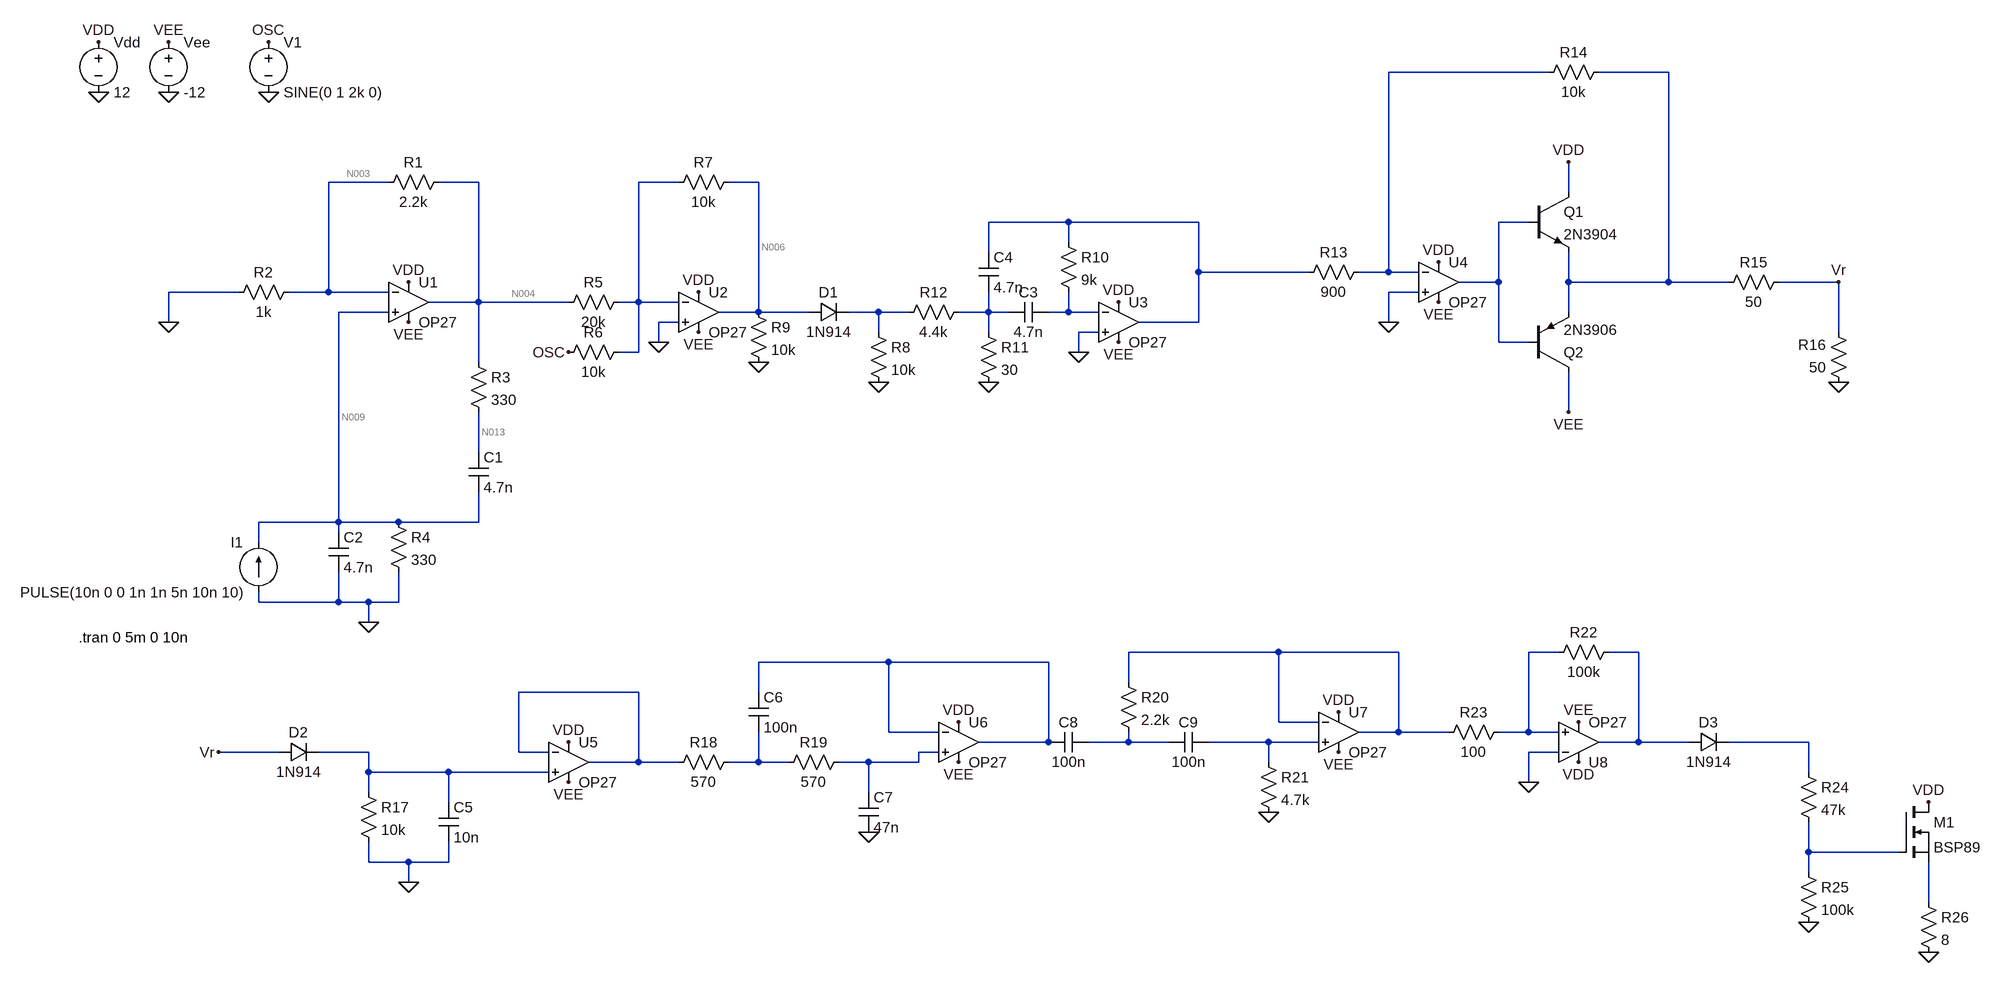
[diagram p0: schematic Project.asc]
Project.asc, the LTspice schematic file:
Version 4
SHEET 1 3028 1572
WIRE 2336 144 2080 144
WIRE 2528 144 2416 144
WIRE 480 320 384 320
WIRE 624 320 560 320
WIRE 944 320 880 320
WIRE 1072 320 1024 320
WIRE 2368 336 2368 288
WIRE 1568 384 1440 384
WIRE 1776 384 1568 384
WIRE 2304 384 2256 384
WIRE 1568 416 1568 384
WIRE 1440 432 1440 384
WIRE 1776 464 1776 384
WIRE 1952 464 1776 464
WIRE 2080 464 2080 144
WIRE 2080 464 2032 464
WIRE 2128 464 2080 464
WIRE 2256 480 2256 384
WIRE 2256 480 2192 480
WIRE 2368 480 2368 432
WIRE 2528 480 2528 144
WIRE 2528 480 2368 480
WIRE 2624 480 2528 480
WIRE 2800 480 2704 480
WIRE 240 496 128 496
WIRE 384 496 384 320
WIRE 384 496 320 496
WIRE 480 496 384 496
WIRE 2128 496 2080 496
WIRE 624 512 624 320
WIRE 624 512 544 512
WIRE 768 512 624 512
WIRE 880 512 880 320
WIRE 880 512 848 512
WIRE 944 512 880 512
WIRE 480 528 400 528
WIRE 1072 528 1072 320
WIRE 1072 528 1008 528
WIRE 1152 528 1072 528
WIRE 1264 528 1216 528
WIRE 1312 528 1264 528
WIRE 1440 528 1440 496
WIRE 1440 528 1392 528
WIRE 1472 528 1440 528
WIRE 1568 528 1568 496
WIRE 1568 528 1536 528
WIRE 1616 528 1568 528
WIRE 2368 528 2368 480
WIRE 128 544 128 496
WIRE 944 544 912 544
WIRE 1776 544 1776 464
WIRE 1776 544 1680 544
WIRE 2080 544 2080 496
WIRE 1264 560 1264 528
WIRE 1440 560 1440 528
WIRE 1616 560 1584 560
WIRE 2800 560 2800 480
WIRE 912 576 912 544
WIRE 2256 576 2256 480
WIRE 2304 576 2256 576
WIRE 880 592 880 512
WIRE 880 592 848 592
WIRE 1584 592 1584 560
WIRE 624 608 624 512
WIRE 2368 688 2368 624
WIRE 624 752 624 688
WIRE 400 864 400 528
WIRE 400 864 272 864
WIRE 496 864 400 864
WIRE 624 864 624 816
WIRE 624 864 496 864
WIRE 400 880 400 864
WIRE 272 896 272 864
WIRE 272 992 272 976
WIRE 400 992 400 944
WIRE 400 992 272 992
WIRE 448 992 400 992
WIRE 496 992 496 944
WIRE 496 992 448 992
WIRE 448 1024 448 992
WIRE 1904 1072 1664 1072
WIRE 2096 1072 1904 1072
WIRE 2352 1072 2304 1072
WIRE 2480 1072 2432 1072
WIRE 1280 1088 1072 1088
WIRE 1536 1088 1280 1088
WIRE 1664 1120 1664 1072
WIRE 880 1136 688 1136
WIRE 1072 1136 1072 1088
WIRE 1904 1184 1904 1072
WIRE 1968 1184 1904 1184
WIRE 1280 1200 1280 1088
WIRE 1360 1200 1280 1200
WIRE 2096 1200 2096 1072
WIRE 2096 1200 2032 1200
WIRE 2176 1200 2096 1200
WIRE 2304 1200 2304 1072
WIRE 2304 1200 2256 1200
WIRE 2352 1200 2304 1200
WIRE 1536 1216 1536 1088
WIRE 1536 1216 1424 1216
WIRE 1664 1216 1664 1200
WIRE 1664 1216 1600 1216
WIRE 1728 1216 1664 1216
WIRE 1888 1216 1792 1216
WIRE 1968 1216 1888 1216
WIRE 2480 1216 2480 1072
WIRE 2480 1216 2416 1216
WIRE 2560 1216 2480 1216
WIRE 2752 1216 2624 1216
WIRE 304 1232 208 1232
WIRE 448 1232 368 1232
WIRE 688 1232 688 1136
WIRE 736 1232 688 1232
WIRE 1360 1232 1328 1232
WIRE 2352 1232 2304 1232
WIRE 880 1248 880 1136
WIRE 880 1248 800 1248
WIRE 944 1248 880 1248
WIRE 1072 1248 1072 1200
WIRE 1072 1248 1024 1248
WIRE 1120 1248 1072 1248
WIRE 1248 1248 1200 1248
WIRE 1328 1248 1328 1232
WIRE 1328 1248 1248 1248
WIRE 1888 1248 1888 1216
WIRE 448 1264 448 1232
WIRE 576 1264 448 1264
WIRE 736 1264 576 1264
WIRE 2752 1264 2752 1216
WIRE 2304 1280 2304 1232
WIRE 448 1296 448 1264
WIRE 1248 1296 1248 1248
WIRE 576 1312 576 1264
WIRE 2752 1392 2752 1344
WIRE 2896 1392 2752 1392
WIRE 448 1408 448 1376
WIRE 512 1408 448 1408
WIRE 576 1408 576 1376
WIRE 576 1408 512 1408
WIRE 2752 1424 2752 1392
WIRE 512 1440 512 1408
WIRE 2944 1472 2944 1408
FLAG 16 176 0
FLAG 128 176 0
FLAG 16 96 VDD
FLAG 128 96 VEE
FLAG 128 544 0
FLAG 512 480 VDD
FLAG 512 544 VEE
FLAG 448 1024 0
FLAG 288 176 0
FLAG 288 96 OSC
FLAG 976 560 VEE
FLAG 976 496 VDD
FLAG 768 592 OSC
FLAG 912 576 0
FLAG 1264 640 0
FLAG 1072 608 0
FLAG 1648 512 VDD
FLAG 1648 576 VEE
FLAG 1440 640 0
FLAG 1584 592 0
FLAG 2368 288 VDD
FLAG 2160 448 VDD
FLAG 2160 512 VEE
FLAG 2080 544 0
FLAG 2368 688 VEE
FLAG 2800 640 0
FLAG 2800 480 Vr
FLAG 768 1216 VDD
FLAG 768 1280 VEE
FLAG 512 1440 0
FLAG 208 1232 Vr
FLAG 1392 1184 VDD
FLAG 1392 1248 VEE
FLAG 1248 1360 0
FLAG 2000 1168 VDD
FLAG 2000 1232 VEE
FLAG 1888 1328 0
FLAG 2384 1184 VEE
FLAG 2384 1248 VDD
FLAG 2304 1280 0
FLAG 2752 1504 0
FLAG 2944 1552 0
FLAG 2944 1312 VDD
SYMBOL voltage 16 80 R0
SYMATTR InstName Vdd
SYMATTR Value 12
SYMBOL voltage 128 80 R0
SYMATTR InstName Vee
SYMATTR Value -12
SYMBOL Opamps\\OP27 512 448 R0
SYMATTR InstName U1
SYMBOL res 576 304 R90
WINDOW 0 0 56 VBottom 2
WINDOW 3 32 56 VTop 2
SYMATTR InstName R1
SYMATTR Value 2.2k
SYMBOL res 336 480 R90
WINDOW 0 0 56 VBottom 2
WINDOW 3 32 56 VTop 2
SYMATTR InstName R2
SYMATTR Value 1k
SYMBOL res 608 592 R0
SYMATTR InstName R3
SYMATTR Value 330
SYMBOL cap 608 752 R0
SYMATTR InstName C1
SYMATTR Value 4.7n
SYMBOL res 480 848 R0
SYMATTR InstName R4
SYMATTR Value 330
SYMBOL cap 384 880 R0
SYMATTR InstName C2
SYMATTR Value 4.7n
SYMBOL current 272 976 R180
WINDOW 0 24 80 Left 2
WINDOW 3 24 0 Left 2
WINDOW 123 0 0 Left 0
WINDOW 39 0 0 Left 0
SYMATTR InstName I1
SYMATTR Value PULSE(10n 0 0 1n 1n 5n 10n 10)
SYMBOL voltage 288 80 R0
WINDOW 123 24 124 Left 2
WINDOW 39 0 0 Left 0
SYMATTR InstName V1
SYMATTR Value SINE(0 1 2k 0)
SYMBOL Opamps\\OP27 976 464 R0
SYMATTR InstName U2
SYMBOL res 864 496 R90
WINDOW 0 0 56 VBottom 2
WINDOW 3 32 56 VTop 2
SYMATTR InstName R5
SYMATTR Value 20k
SYMBOL res 864 576 R90
WINDOW 0 0 56 VBottom 2
WINDOW 3 32 56 VTop 2
SYMATTR InstName R6
SYMATTR Value 10k
SYMBOL res 1040 304 R90
WINDOW 0 0 56 VBottom 2
WINDOW 3 32 56 VTop 2
SYMATTR InstName R7
SYMATTR Value 10k
SYMBOL diode 1152 544 R270
WINDOW 0 32 32 VTop 2
WINDOW 3 0 32 VBottom 2
SYMATTR InstName D1
SYMATTR Value 1N914
SYMBOL res 1248 544 R0
SYMATTR InstName R8
SYMATTR Value 10k
SYMBOL res 1056 512 R0
SYMATTR InstName R9
SYMATTR Value 10k
SYMBOL Opamps\\OP27 1648 480 R0
SYMATTR InstName U3
SYMBOL res 1552 400 R0
SYMATTR InstName R10
SYMATTR Value 9k
SYMBOL cap 1536 512 R90
WINDOW 0 0 32 VBottom 2
WINDOW 3 32 32 VTop 2
SYMATTR InstName C3
SYMATTR Value 4.7n
SYMBOL cap 1424 432 R0
SYMATTR InstName C4
SYMATTR Value 4.7n
SYMBOL res 1424 544 R0
SYMATTR InstName R11
SYMATTR Value 30
SYMBOL res 1408 512 R90
WINDOW 0 0 56 VBottom 2
WINDOW 3 32 56 VTop 2
SYMATTR InstName R12
SYMATTR Value 4.4k
SYMBOL npn 2304 336 R0
SYMATTR InstName Q1
SYMATTR Value 2N3904
SYMBOL Opamps\\OP27 2160 416 R0
SYMATTR InstName U4
SYMBOL res 2048 448 R90
WINDOW 0 0 56 VBottom 2
WINDOW 3 32 56 VTop 2
SYMATTR InstName R13
SYMATTR Value 900
SYMBOL res 2432 128 R90
WINDOW 0 0 56 VBottom 2
WINDOW 3 32 56 VTop 2
SYMATTR InstName R14
SYMATTR Value 10k
SYMBOL pnp 2304 624 M180
SYMATTR InstName Q2
SYMATTR Value 2N3906
SYMBOL res 2720 464 R90
WINDOW 0 0 56 VBottom 2
WINDOW 3 32 56 VTop 2
SYMATTR InstName R15
SYMATTR Value 50
SYMBOL res 2816 656 R180
WINDOW 0 36 76 Left 2
WINDOW 3 36 40 Left 2
SYMATTR InstName R16
SYMATTR Value 50
SYMBOL diode 304 1248 R270
WINDOW 0 32 32 VTop 2
WINDOW 3 0 32 VBottom 2
SYMATTR InstName D2
SYMATTR Value 1N914
SYMBOL res 432 1280 R0
SYMATTR InstName R17
SYMATTR Value 10k
SYMBOL cap 560 1312 R0
SYMATTR InstName C5
SYMATTR Value 10n
SYMBOL Opamps\\OP27 768 1184 R0
SYMATTR InstName U5
SYMBOL res 1040 1232 R90
WINDOW 0 0 56 VBottom 2
WINDOW 3 32 56 VTop 2
SYMATTR InstName R18
SYMATTR Value 570
SYMBOL res 1216 1232 R90
WINDOW 0 0 56 VBottom 2
WINDOW 3 32 56 VTop 2
SYMATTR InstName R19
SYMATTR Value 570
SYMBOL cap 1056 1136 R0
SYMATTR InstName C6
SYMATTR Value 100n
SYMBOL cap 1232 1296 R0
SYMATTR InstName C7
SYMATTR Value 47n
SYMBOL Opamps\\OP27 1392 1152 R0
SYMATTR InstName U6
SYMBOL res 1648 1104 R0
SYMATTR InstName R20
SYMATTR Value 2.2k
SYMBOL res 1872 1232 R0
SYMATTR InstName R21
SYMATTR Value 4.7k
SYMBOL cap 1600 1200 R90
WINDOW 0 0 32 VBottom 2
WINDOW 3 32 32 VTop 2
SYMATTR InstName C8
SYMATTR Value 100n
SYMBOL cap 1792 1200 R90
WINDOW 0 0 32 VBottom 2
WINDOW 3 32 32 VTop 2
SYMATTR InstName C9
SYMATTR Value 100n
SYMBOL Opamps\\OP27 2000 1136 R0
SYMATTR InstName U7
SYMBOL Opamps\\OP27 2384 1280 M180
SYMATTR InstName U8
SYMBOL res 2448 1056 R90
WINDOW 0 0 56 VBottom 2
WINDOW 3 32 56 VTop 2
SYMATTR InstName R22
SYMATTR Value 100k
SYMBOL res 2272 1184 R90
WINDOW 0 0 56 VBottom 2
WINDOW 3 32 56 VTop 2
SYMATTR InstName R23
SYMATTR Value 100
SYMBOL diode 2560 1232 R270
WINDOW 0 32 32 VTop 2
WINDOW 3 0 32 VBottom 2
SYMATTR InstName D3
SYMATTR Value 1N914
SYMBOL res 2736 1248 R0
SYMATTR InstName R24
SYMATTR Value 47k
SYMBOL res 2736 1408 R0
SYMATTR InstName R25
SYMATTR Value 100k
SYMBOL nmos 2896 1312 R0
SYMATTR InstName M1
SYMATTR Value BSP89
SYMBOL res 2928 1456 R0
SYMATTR InstName R26
SYMATTR Value 8
TEXT -16 1048 Left 2 !.tran 0 5m 0 10n

The netlist it stands for:
* Project.asc
Vdd VDD 0 12
Vee VEE 0 -12
XU1 N009 N003 VDD VEE N004 OP27  ; pins In+ In- V+ V- OUT
R1 N004 N003 2.2k
R2 N003 0 1k
R3 N004 N013 330
C1 N013 N009 4.7n
R4 N009 0 330
C2 N009 0 4.7n
I1 0 N009 PULSE(10n 0 0 1n 1n 5n 10n 10)
V1 OSC 0 SINE(0 1 2k 0)
XU2 0 N005 VDD VEE N006 OP27  ; pins In+ In- V+ V- OUT
R5 N005 N004 20k
R6 N005 OSC 10k
R7 N006 N005 10k
D1 N006 N010 1N914
R8 N010 0 10k
R9 N006 0 10k
XU3 0 N012 VDD VEE N007 OP27  ; pins In+ In- V+ V- OUT
R10 N007 N012 9k
C3 N012 N011 4.7n
C4 N007 N011 4.7n
R11 N011 0 30
R12 N011 N010 4.4k
Q1 VDD N008 N002 0 2N3904
XU4 0 N001 VDD VEE N008 OP27  ; pins In+ In- V+ V- OUT
R13 N001 N007 900
R14 N002 N001 10k
Q2 VEE N008 N002 0 2N3906
R15 Vr N002 50
R16 0 Vr 50
D2 Vr N022 1N914
R17 N022 0 10k
C5 N022 0 10n
XU5 N022 N018 VDD VEE N018 OP27  ; pins In+ In- V+ V- OUT
R18 N024 N018 570
R19 N023 N024 570
C6 N017 N024 100n
C7 N023 0 47n
XU6 N023 N017 VDD VEE N017 OP27  ; pins In+ In- V+ V- OUT
R20 N014 N019 2.2k
R21 N020 0 4.7k
C8 N019 N017 100n
C9 N020 N019 100n
XU7 N020 N014 VDD VEE N014 OP27  ; pins In+ In- V+ V- OUT
XU8 N015 0 VDD VEE N016 OP27  ; pins In+ In- V+ V- OUT
R22 N016 N015 100k
R23 N015 N014 100
D3 N016 N021 1N914
R24 N021 N025 47k
R25 N025 0 100k
M1 VDD N025 N026 N026 BSP89
R26 N026 0 8
.model D D
.lib standard.dio
.model NPN NPN
.model PNP PNP
.lib standard.bjt
.model NMOS NMOS
.model PMOS PMOS
.lib standard.mos
.tran 0 5m 0 10n
.lib ADI.lib
.backanno
.end

* Results of the author's LTspice run, read from the files saved beside the schematic
* Operating Point, zero values left out:
*   V(vdd) = 12 V
*   V(vee) = -12 V
*   V(n003) = 3.3 µV
*   V(n009) = 3.3 µV
*   V(n004) = 10.56 µV
*   V(n013) = 10.56 µV
*   V(n006) = -5.28 µV
*   Ic(Q2) = -12.01 pA
*   Ib(Q2) = 12 pA
*   Ic(Q1) = 12.01 pA
*   Ib(Q1) = -12 pA
*   Id(M1) = 12.59 pA
*   Is(M1) = -12.59 pA
*   I(I1) = 10 nA
*   I(R26) = 24.6 pA
*   I(R9) = -528 pA
*   I(R7) = -528 pA
*   I(R5) = -528 pA
*   I(R4) = 10 nA
*   I(R2) = 3.3 nA
*   I(R1) = 3.3 nA
*   I(Vee) = 22.54 mA
*   I(Vdd) = -22.54 mA